# EAGLE design ESP-WROOM-02-Pro-Mini_v1.1 (EAGLE 7.3.0)
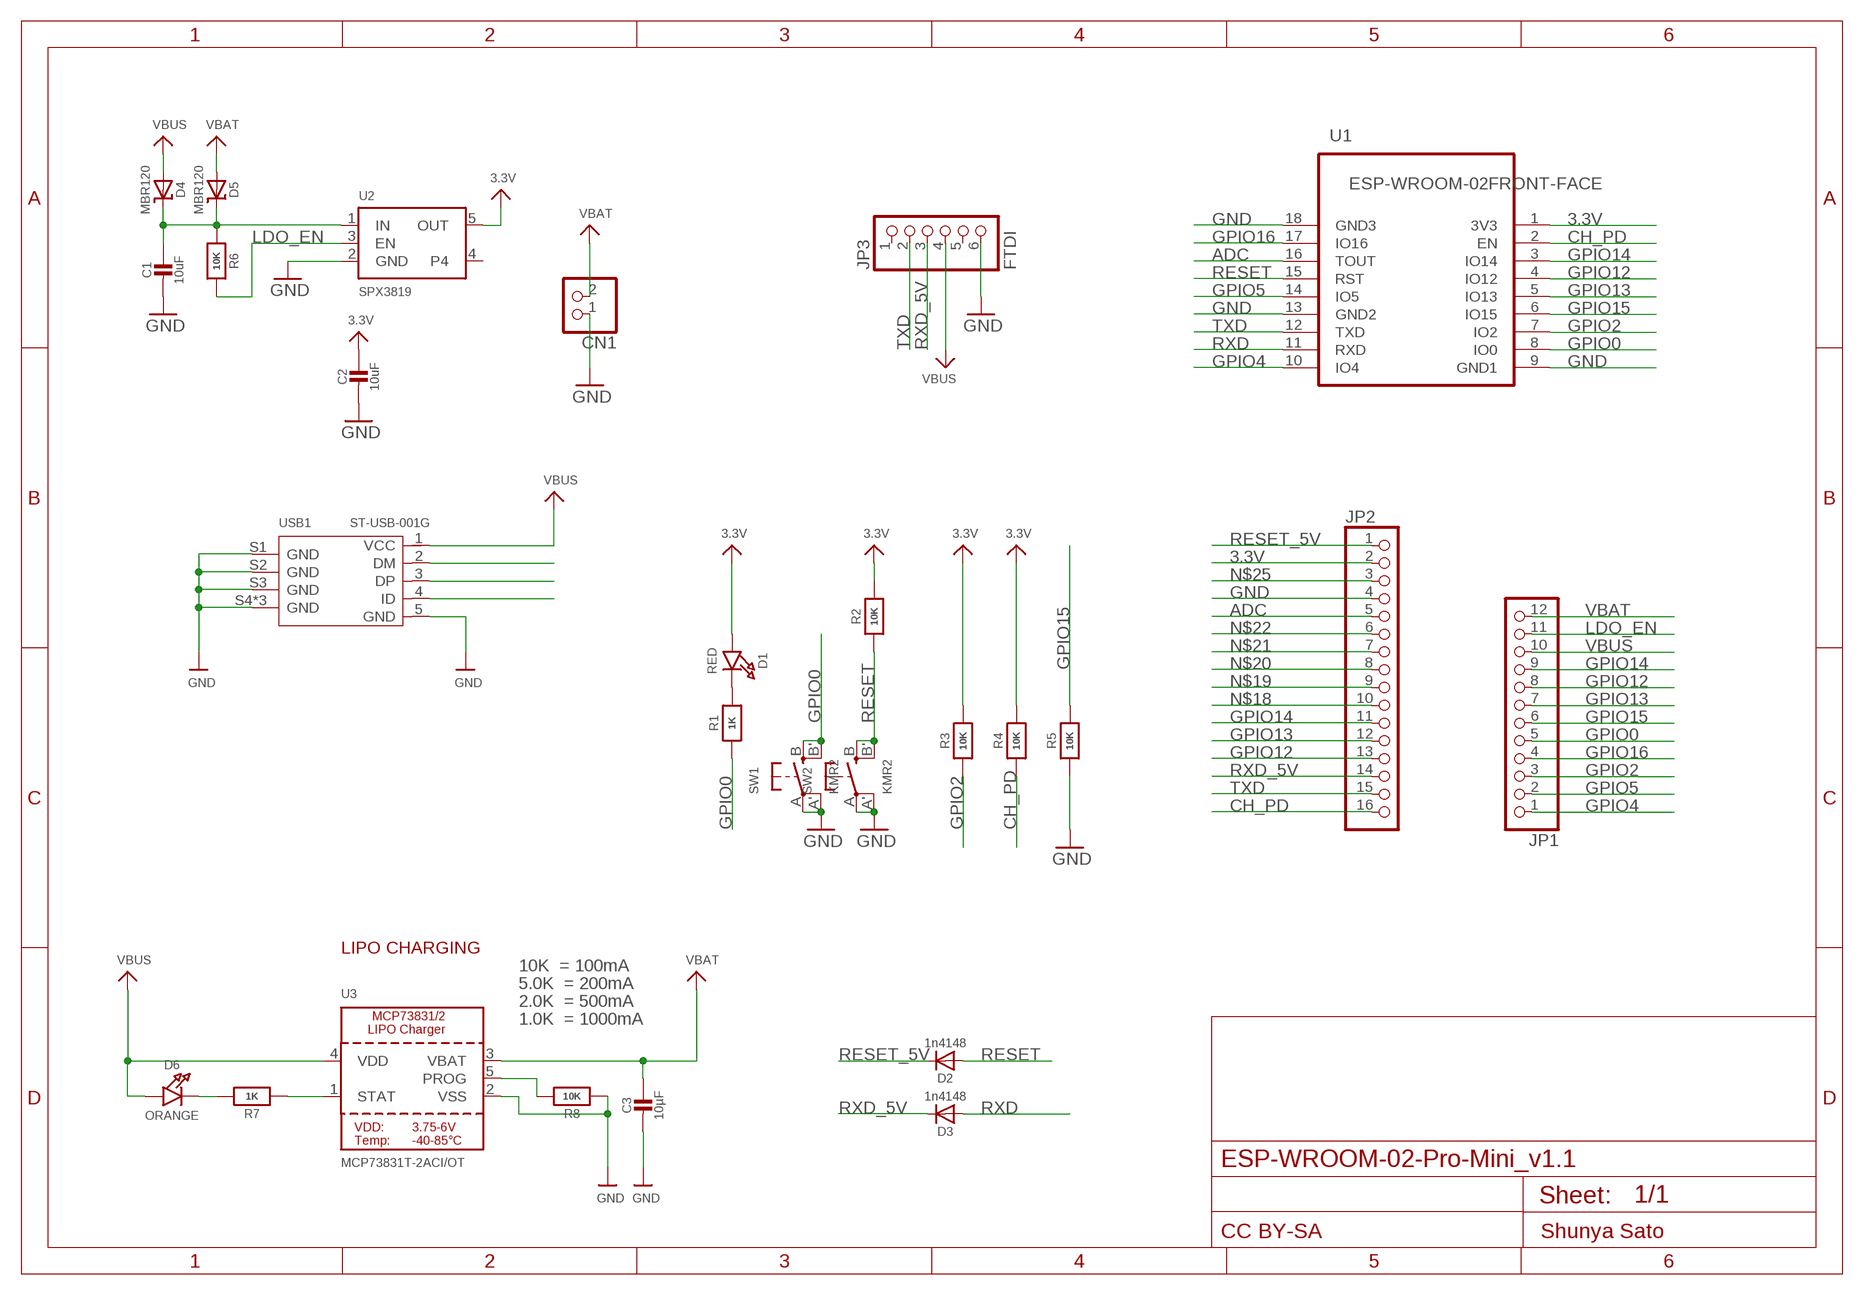
[diagram p0: schematic, sheet 1]

## Parts
C1  10uF  CAP_CERAMIC0805-NOOUTLINE  [0805-NO]
C2  10uF  CAP_CERAMIC0805-NOOUTLINE  [0805-NO]
C3  10µF  CAP_CERAMIC0805-NOOUTLINE  [0805-NO]
CN1  JST_2PIN  [JSTPH2]
D1  RED  LED0805_NOOUTLINE  [CHIPLED_0805_NOOUTLINE]
D2  1n4148  DIODESOD-323  [SOD-323]
D3  1n4148  DIODESOD-323  [SOD-323]
D4  MBR120  DIODE-SCHOTTKYSOD-123  [SOD-123]
D5  MBR120  DIODE-SCHOTTKYSOD-123  [SOD-123]
D6  ORANGE  LED0805_NOOUTLINE  [CHIPLED_0805_NOOUTLINE]
JP1  PINHD-1X12-CB  [1X12-CB]
JP2  HEADER-1X16ROUND  [1X16_ROUND]
JP3  FTDI  HEADER-1X670MIL  [1X06_ROUND_70]
R1  1K  RESISTOR0805_NOOUTLINE  [0805-NO]
R2  10K  RESISTOR0805_NOOUTLINE  [0805-NO]
R3  10K  RESISTOR0805_NOOUTLINE  [0805-NO]
R4  10K  RESISTOR0805_NOOUTLINE  [0805-NO]
R5  10K  RESISTOR0805_NOOUTLINE  [0805-NO]
R6  10K  RESISTOR0805_NOOUTLINE  [0805-NO]
R7  1K  RESISTOR0805_NOOUTLINE  [0805-NO]
R8  10K  RESISTOR0805_NOOUTLINE  [0805-NO]
SW1  KMR2  SWITCH_TACT_SMT4.6X2.8  [BTN_KMR2_4.6X2.8]
SW2  KMR2  SWITCH_TACT_SMT4.6X2.8  [BTN_KMR2_4.6X2.8]
U1  ESP-WROOM-02FRONT-FACE  [FRONT-FACE]
U2  SPX3819  VREG_SOT23-5  [SOT23-5]
U3  MCP73831T-2ACI/OT  MCP73831/2  [SOT23-5]
USB1  ST-USB-001G  MICRO-USB-SMD-B-WITHOUT-POST-W/P(ST-USB-001G)  [MICRO-USB5+4P-SMD-0.65-B]

## Nets
3.3V: C2.1 D1.A JP2.2 R2.2 R3.2 R4.2 U1.1(3V3) U2.5(OUT)
ADC: JP2.5 U1.16(TOUT)
CH_PD: JP2.16 R4.1 U1.2(EN)
GND: C1.2 C2.2 C3.2 CN1.1 JP2.4 JP3.6 R5.1 R8.1 SW1.A'(P1) SW1.A(P) SW2.A'(P1) SW2.A(P) U1.9(GND1) U1.13(GND2) U1.18(GND3) U2.2(GND) U3.2(VSS) USB1.5(GND) USB1.S1(GND) USB1.S2(GND) USB1.S3(GND) USB1.S4(GND) USB1.S5(GND) USB1.S6(GND)
GPIO0: JP1.5 R1.1 SW1.B'(S1) SW1.B(S) U1.8(IO0)
GPIO2: JP1.3 R3.1 U1.7(IO2)
GPIO4: JP1.1 U1.10(IO4)
GPIO5: JP1.2 U1.14(IO5)
GPIO12: JP1.8 JP2.13 U1.4(IO12)
GPIO13: JP1.7 JP2.12 U1.5(IO13)
GPIO14: JP1.9 JP2.11 U1.3(IO14)
GPIO15: JP1.6 R5.2 U1.6(IO15)
GPIO16: JP1.4 U1.17(IO16)
LDO_EN: JP1.11 R6.2 U2.3(EN)
N$1: D6.C R7.2
N$2: R7.1 U3.1(STAT)
N$3: C1.1 D4.C D5.C R6.1 U2.1(IN)
N$6: D1.C R1.2
N$8: USB1.4(ID)
N$14: USB1.3(DP)
N$15: USB1.2(DM)
N$18: JP2.10
N$19: JP2.9
N$20: JP2.8
N$21: JP2.7
N$22: JP2.6
N$25: JP2.3
N$32: R8.2 U3.5(PROG)
RESET: D2.A R2.1 SW2.B'(S1) SW2.B(S) U1.15(RST)
RESET_5V: D2.C JP2.1
RXD: D3.A U1.11(RXD)
RXD_5V: D3.C JP2.14 JP3.3
TXD: JP2.15 JP3.2 U1.12(TXD)
VBAT: C3.1 CN1.2 D5.A JP1.12 U3.3(VBAT)
VBUS: D4.A D6.A JP1.10 JP3.4 U3.4(VDD) USB1.1(VCC)
Unconnected: JP3.1 JP3.5 U2.4

## Notes on the sheet
- LIPO CHARGING
- 10K  = 100mA
- 5.0K  = 200mA
- 2.0K  = 500mA
- 1.0K  = 1000mA
- CC BY-SA | Shunya Sato

## Library data of the parts
C1-C3 = microbuilder:CAP_CERAMIC: Ceramic Capacitors For new designs, use the packages preceded by an '_' character since they are more reliable: The following footprints should be used on most boards: _0402 - Standard footprint for regular board layouts _0603 - Standard footprint for regular board layouts _0805 - Standard footprint for regular board layouts _1206 - Standard footprint for regular board layouts For extremely tight-pitch boards where space is at a premium, the following 'micro-pitch' footprints can be used (smaller pads, no silkscreen outline, etc.): _0402MP - Micro-pitch footprint for very dense/compact boards _0603MP - Micro-pitch footprint for very dense/compact boards _0805MP - Micro-pitch footprint for very dense/compact boards _1206MP - Micro-pitch footprint for very dense/compact boards
CN1 = microbuilder:JST_2PIN: JST 2-Pin Right-Angle Connector PH-Series - 4UConnector: 17311 SH-Series - 4UConnector: 07278
D1 D6 = microbuilder:LED: LED 0603 - 0603 Surface Mount Package 2mA: Green LED - Low Power (3.9mcd, 2ma, 1.7Vf) - Digikey: 475-2709-2-ND Orange LED - Low Power (9.8mcd, 2ma, 1.8Vf) - Digikey: 475-1194-2-ND Red LED - Low Power (5mcd, 2ma, 1.8Vf) - Digikey: 475-1195-2-ND Yellow LED - Low Power (7mcd, 2ma, 1.8Vf) - Digikey: 475-1196-2-ND 5mA: Blue LED - Low Power (17mcd, 5ma, 2.9Vf) - Digikey: LNJ937W8CRACT-ND 0805 - 0805 Surface Mount Package 2mA: Red LED (8.8mcd, 2mA, 1.8Vf, Clear) - Low Power [Digikey: 475-2510-1-ND] Green LED (5mcd, 2mA, 1.8Vf, Clear) - Low Power [Digikey: 475-2730-1-ND] Yellow LED (11.3mcd, 2mA, 1.8Vf, Clear) - Low Power [Digikey: 475-2555-1-ND] 20mA: Red LED (104mcd, 20mA, Diffused) - LS R976 [Digikey: 475-1278-6-ND] Red LED (12mcd, 20mA, 2.0Vf, Clear) - APT2012EC [Digikey: 754-1128-1-ND] Green LED (15mcd, 20mA, 2.2Vf, Clear) - APT2012GC [Digikey: 754-1131-1-ND] Orange LED (160mcd, 20mA, 2.1Vf, Clear) - APT2012SECK [Digikey: 754-1130-1-ND] 1206 - 1206 Surface Mount Package Green LED (26mcd, 20mA, Diffused) - LG N971 [Digikey: 475-1407-6-ND] Red LED (15mcd, 20mA, Diffused) - LH N974 [Digikey: 475-1416-6-ND] Cree - Cree High-Power Surface Mount LEDs XPEBWT-L1-0000-00D50 - White 111lm 350mA 2.9Vf 6200K 110° XTEAWT-00-0000-00000LEE3 - White 114lm 350mA 2.85Vf 5000K 115° Everlight - Everlight 45-21 Series Surface Mount LEDs 45-21/QK2C-B2832AC2CB2/2T - Warm White 2000mcd 20mA 3.25Vf 3050K 120° 45-21/LK2C-B38452C4CB2/2T - Nuetral White 2000mcd 20mA 3.25Vf 4150K 120° 45-21/LK2C-B50634C6CB2/2T - Cold White 2200mcd 20mA 3.25Vf 5650K 120° PLCC2 Reverse Mount LS T77K-J1L2-1-0-2-R18-Z - Red 11.25mcd 2mA 1.8Vf 630nm 120° LO T77K-L1M2-24-Z - Orange 19.6mcd 2mA 1.8Vf 606nm 120° LY T77K-K2M1-26-Z - Yellow 15.7mcd 2mA 1.8Vf 587nm 120°
D2 D3 = microbuilder:DIODE: Diode SMA Model Volts Amps Type Vf Ir Digikey # Notes SSA34-E3 40V 3A Schottky 480mV @ 3A 200uA @ 40V SSA34-E3/61TGITR-ND CDBA120-G 20V 1A Schottky 500mV @ 1A 500uA @ 20V 641-1014-6-ND REEL MBRA210 10V 2A Schottky 350mV @ 2A 700uA @ 10V MBRA210LT3 SOD-123 Model Volts Amps Type Vf Ir Order # Notes BAT54T1G 30V 200mA Schottky 800mV @ 200mA 2uA @ 25V BAT54T1GOSTR-ND B0530W 30V 500mA Schottky 430mV @ 500mA 130uA @ 30V B0530W-FDICT-ND REEL MBR120 20V 1A Schottky 340mV @ 1A MBR120VLSFT1GOSCT-ND SOD-323 Model Volts Amps Type Vf Ir Order # Notes PMEG2005EJ 20V 500mA Schottky 355mV @ 500mA 568-4110-1-ND ZLLS410 10V 570mA Schottky 380mV @ 570mA ZLLS410CT-ND 1N4148WS 75V 150mA Silicon/Simple 1V 1N4148WSFSCT-ND REEL SOD-523 Model Volts Amps Type Vf Ir Order # Notes BAT54XV2 30V 200mA Schottky 0.8V @ 100mA BAT54XV2CT-ND TB751S 30V 30mA Schottky RB751S-40TE61CT-ND SOT23-R/W (R = Solder Paste/Reflow Ovens, W = Hand-Soldering) Model Volts Amps Type Vf Ir Order # Notes BAT54FILM 40V 300mA Schottky 497-7162-1-ND POWERDI-5 Model Volts Amps Type Vf Ir Order # Notes PDS560 60V 5A Schottky 670mV @ 5A 150uA @ 60V PDS560DICT-ND
D4 D5 = microbuilder:DIODE-SCHOTTKY
JP1 = adafruit:PINHD-1X12: PIN HEADER
JP2 = microbuilder:HEADER-1X16: PIN HEADER
JP3 = microbuilder:HEADER-1X6: PIN HEADER
R1-R8 = microbuilder:RESISTOR: Resistors For new designs, use the packages preceded by an '_' character since they are more reliable: The following footprints should be used on most boards: _0402 - Standard footprint for regular board layouts _0603 - Standard footprint for regular board layouts _0805 - Standard footprint for regular board layouts _1206 - Standard footprint for regular board layouts For extremely tight-pitch boards where space is at a premium, the following 'micro-pitch' footprints can be used (smaller pads, no silkscreen outline, etc.): _0402MP - Micro-pitch footprint for very dense/compact boards _0603MP - Micro-pitch footprint for very dense/compact boards _0805MP - Micro-pitch footprint for very dense/compact boards _1206MP - Micro-pitch footprint for very dense/compact boards
SW1 SW2 = microbuilder:SWITCH_TACT_SMT: SMT Tact Switches 6x6mm - Digikey: P12940SCT-ND KMR2 (4.6x2.8mm) - Digikey: 401-1426-1-ND EVQ-PQHB55 - Light Touch, 160GF (4.5x4.5mm) - Digikey: P8090SCT-ND KMT0 - KMT021 NGJ LHS (etc.) IP68/Waterproof - Digikey: CKN10289CT-ND
U1 = esp-wroom-02:ESP-WROOM-02: WiFi module - ESP-WROOM-02
U2 = microbuilder:VREG_SOT23-5: SOT23-5 Fixed Voltage Regulators Part Current Out V Out V In V Dropout θJA (°C/W) TJ (°C) Digikey Part No. ADP121 150mA 3.3V 3.4-5.5V 0.09V @ 150mA -- -- ADP121-AUJZ33R7CT-ND ADP121 150mA 3.0V 3.1-5.5V 0.09V @ 150mA -- -- ADP121-AUJZ30R7CT-ND ADP122 300mA 3.3V 3.4-5.5V 0.085V @ 300mA -- -- ADP122AUJZ-3.3-R7CT-ND ADP1712 300mA 3.3V 3.5-5.5V 0.17V @ 300mA -- -- ADP1712AUJZ-3.3-R7TR-ND AP7311 (Low Cost) 150mA 3.3V 3.5-6V 0.15V @ 150mA -- -- AP7311-33WG-7DICT-ND LD39015M18R 150mA 1.8V 1.9V-5.5V 0.08V @ 100mA -- -- 497-6977-1-ND LP2985A-33DBVR 150mA 3.3V 3.3-16V 0.28V @ 150mA 206 150 296-18479-1-ND MCP1824T-3302E/OT 300mA 3.3V 3.5V-6V 0.2V @ 300mA -- -- MCP1824T-3302E/OTCT-ND MIC5205-2.5YM5 TR 150mA 2.5V 2.7-16V 0.165V @ 150mA -- -- 576-1257-2-ND MIC5205-3.0YM5 TR 150mA 3.0V 3.2V-16V 0.165V @ 150mA -- -- 576-1258-2-ND MIC5205-3.3YM5 TR 150mA 3.3V 3.5V-16V 0.165V @ 150mA -- -- 576-1259-2-ND TPS780330220 150mA 3.3V+2.2V 3.6-5.5V 250mV Max -- -- 296-23332-1-ND TDA3663/N1,135 100mA 3.3V 3.5-45V 0.18V @ 50mA -- -- 568-5343-1-ND Max operating temp can be calculated using θJA, TJ (max junction temperature), and power in watts. Set the "Maximum Ambient Temperature" until it reaches TJ ("Max Junction Temperature"), which is the absolute limit for safe use of the regulator: Heat Sink Temperature Calculator <http://www.daycounter.com/Calculators/Heat-Sink-Temperature-Calculator.phtml> For example, With 12V source into a 3.3V LP2985 and a 30mA load, we are dissipating (12V-3.3V) * 0.03A = 0.261W. With a θJA of 206 °C/W, a TJ of 150°C, and 261mW we can safely use the chip without a heat sink up to 75°C (=147.1°C Junction Temperature).
U3 = microbuilder:MCP73831/2: MCP73831/2 LIPO Charger VDD: 3.75 - 6V Temp -40 - 85°C Programmable Charge Rate: 15-500mA NOTE: STAT is a tri-state logic output on the MCP73831 and an open-drain output on the MCP73832. SOT23-5 with 4.2V output and tri-state logic on STAT = MCP73831T-2ACI/OT
USB1 = Seeed-OPL-Connector:MICRO-USB-SMD-B-WITHOUT-POST-W/P(ST-USB-001G): 320010000; MPN: ST-USB-001G

## Board
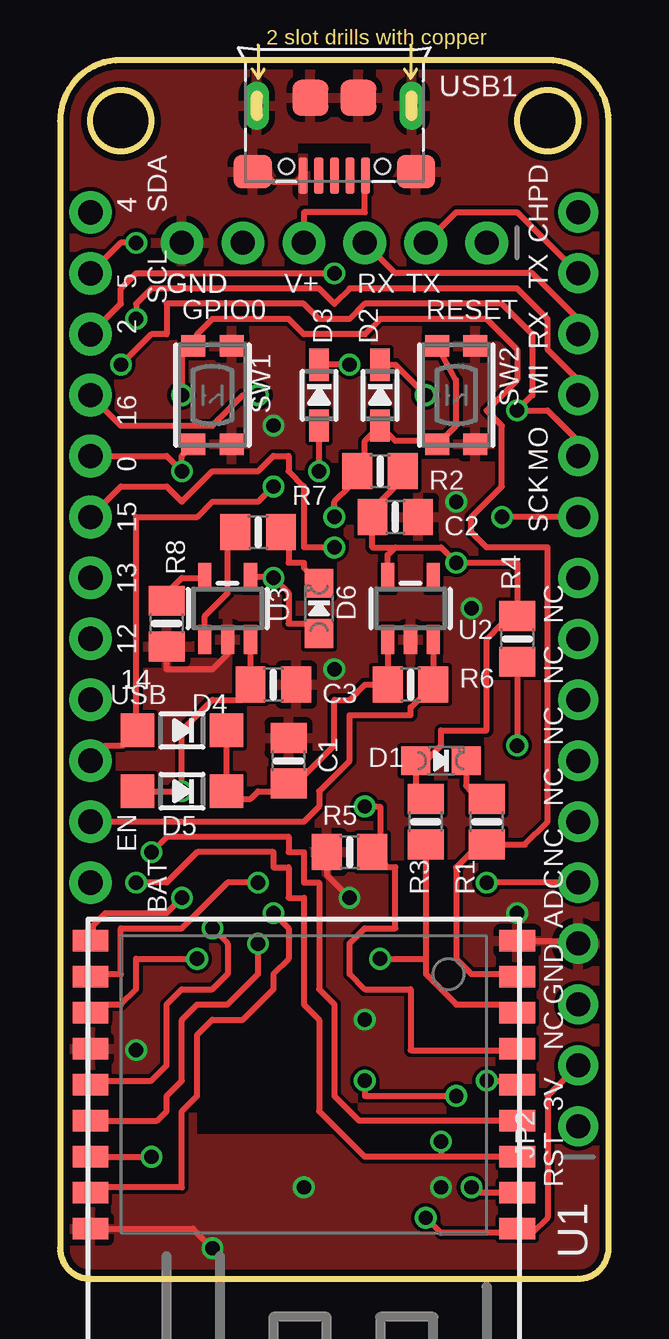
[diagram p1: board, top side]
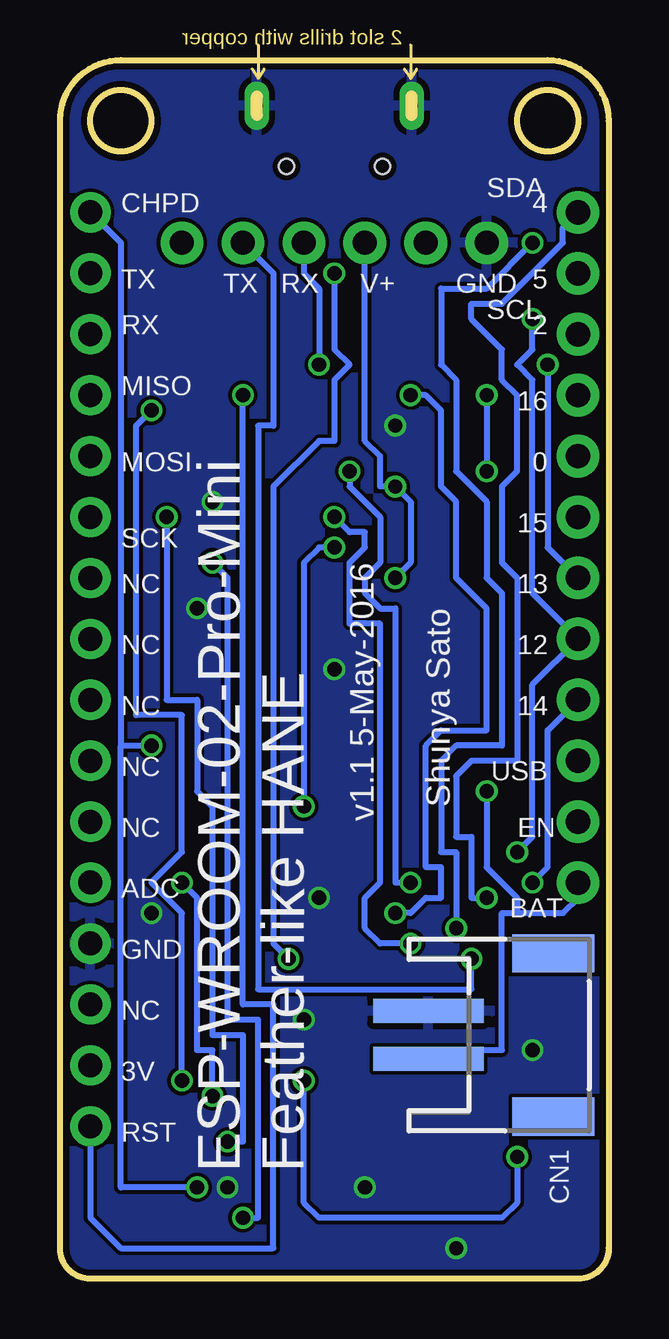
[diagram p2: board, bottom side, seen from below]

Size 22.86 x 50.8 mm. Coordinates in mm from the lower left corner, seen from the top.
Outline: 22.86,1.27 22.86,48.26 arc90 20.32,50.8 2.54,50.8 arc90 0,48.26 0,1.27 arc90 1.27,0 21.59,0 arc90 22.86,1.27
Outline: circle at 2.54,48.26 radius 1.27
Outline: circle at 20.32,48.26 radius 1.27
Copper layers (1*16): Top 0.035mm / dielectric 1.5mm / Bottom 0.035mm
Design rules "SeeedStudio_2layer_DRU_no_angle_20140221": minimum track width 6mil, minimum drill 12mil, track to track 6mil, track to pad 6mil, pad to pad 6mil, via to via 6mil, smd to smd 0mil, copper to edge 10mil, drill to drill 10mil, minimum pad ring 10mil, minimum via ring 6mil, stop-mask expansion 2mil, vias tented up to drill 100mil, thermal gap 10mil

### Footprints (pad centres in the part's own frame; a part is rotated, then mirrored left to right if it is on the bottom)
0805-NO = smd 1.24 x 1.5: 1 -0.95,0; 2 0.95,0
JSTPH2 = smd 1 x 4.6: 1 -1,-3.7; 2 1,-3.7 | smd 1.6 x 3.4: NC1 -3.4,1.5; NC2 3.4,1.5
CHIPLED_0805_NOOUTLINE = smd 1.2 x 1.2: A 0,-1.05; C 0,1.05
SOD-323 = smd 1.35 x 0.8: A 1.27,0; C -1.27,0
SOD-123 = smd 1.4 x 1.4: A 1.85,0; C -1.85,0
1X12-CB = drill 1.016 pad 1.778: 1 -13.97,0; 2 -11.43,0; 3 -8.89,0; 4 -6.35,0; 5 -3.81,0; 6 -1.27,0; 7 1.27,0; 8 3.81,0; 9 6.35,0; 10 8.89,0; 11 11.43,0; 12 13.97,0
1X16_ROUND = drill 1 pad 1.676: 1 -19.05,0; 2 -16.51,0; 3 -13.97,0; 4 -11.43,0; 5 -8.89,0; 6 -6.35,0; 7 -3.81,0; 8 -1.27,0; 9 1.27,0; 10 3.81,0; 11 6.35,0; 12 8.89,0; 13 11.43,0; 14 13.97,0; 15 16.51,0; 16 19.05,0
1X06_ROUND_70 = drill 1 pad 1.778: 1 -6.35,0; 2 -3.81,0; 3 -1.27,0; 4 1.27,0; 5 3.81,0; 6 6.35,0
BTN_KMR2_4.6X2.8 = smd 0.9 x 1: A 2.05,0.8; A' -2.05,0.8; B 2.05,-0.8; B' -2.05,-0.8
FRONT-FACE = smd 1.485 x 0.9: 1 -8.893,4.9; 2 -8.893,3.4; 3 -8.893,1.9; 4 -8.893,0.4; 5 -8.893,-1.1; 6 -8.893,-2.6; 7 -8.893,-4.1; 8 -8.893,-5.6; 9 -8.893,-7.1; 10 8.893,-7.1; 11 8.893,-5.6; 12 8.893,-4.1; 13 8.893,-2.6; 14 8.893,-1.1; 15 8.893,0.4; 16 8.893,1.9; 17 8.893,3.4; 18 8.893,4.9
SOT23-5 = smd 0.55 x 1.2: 1 -0.95,-1.3; 2 0,-1.3; 3 0.95,-1.3; 4 0.95,1.3; 5 -0.95,1.3
MICRO-USB5+4P-SMD-0.65-B = smd 0.381 x 1.524: 1 -1.3,-0.25; 2 -0.65,-0.25; 3 0,-0.25; 4 0.65,-0.25; 5 1.3,-0.25 | smd 1.6 x 1.397: S1 -3.4,-0.427; S6 3.4,-0.427 | drill 0.508 pad 1.016 long: S2 -3.226,-3.175; S5 3.226,-3.175 | smd 1.5 x 1.5: S3 -1,-3.5; S4 1,-3.5 | hole 0.635: -2,-0.65; 2,-0.65

### Placement (x,y rotation side)
C1  9.52,21.59 90 top
C2  13.97,31.75 0 top
C3  8.89,24.77 0 top
CN1  3.81,10.16 270 bottom
D1  15.88,21.59 270 top
D2  13.33,36.83 270 top
D3  10.79,36.83 270 top
D4  5.08,22.86 180 top
D5  5.08,20.32 180 top
D6  10.79,27.94 0 top
JP1  1.27,30.48 270 top
JP2  21.59,25.4 90 top
JP3  11.43,43.18 180 top
R1  17.78,19.05 90 top
R2  13.33,33.66 0 top
R3  15.24,19.05 90 top
R4  19.05,26.67 90 top
R5  12.06,17.78 0 top
R6  14.6,24.77 0 top
R7  8.25,31.11 0 top
R8  4.45,27.3 90 top
SW1  6.35,36.83 270 top
SW2  16.51,36.83 270 top
U1  10.16,6.99 180 top
U2  14.6,27.94 0 top
U3  6.98,27.94 0 top
USB1  11.43,45.72 180 top

### Tracks (layer width: path | path; a pad name or v marks a point on that pad's centre or on a via)
3.3V  (via drill 0.6)
  Top 0.254: 19.23,1.91 15.88,1.91 v15.24,2.54 | 19.23,1.91 19.68,1.91 20.32,2.54 20.32,7.62 JP2.2 | 19.23,1.91 U1.1 | C2.1 13.33,31.75 | 13.97,30.48 13.02,30.48 C2.1 | 13.97,30.48 15.88,30.48 v16.51,29.84 19.05,29.84 R4.2 18.73,27.3 18.41,27.3 17.78,26.67 17.78,22.86 15.88,22.86 15.88,22.23 15.24,21.59 D1.A 14.82,20.41 R3.2 | C2.1 12.7,31.75 13.02,31.43 13.33,31.43 | R2.2 14.28,33.34 13.33,32.38 13.33,32.06 C2.1 | U2.5 13.65,30.16 13.97,30.48
  Bottom 0.254: v15.24,2.54 14.6,2.54 14.6,10.79 15.88,10.79 15.88,29.21 v16.51,29.84
ADC  (via drill 0.6)
  Top 0.254: v12.7,8.26 12.7,7.62 v16.51,7.62 | JP2.5 v17.78,16.51 | U1.16 v3.8,5.08 v3.81,5.08
  Bottom 0.254: v12.7,8.26 12.7,3.17 12.06,2.54 4.45,2.54 3.81,3.17 v3.81,5.08 | v16.51,7.62 16.51,9.53 17.14,9.53 17.14,15.88 v17.78,16.51
CH_PD  (via drill 0.6)
  Top 0.254: U1.2 17.37,3.58 v17.14,3.81 | R4.1 v19.05,22.23
  Bottom 0.254: v17.14,3.81 20.32,3.81 20.32,22.23 | 20.32,22.23 20.32,43.18 JP2.16 | 20.32,22.23 v19.05,22.23
GND  (via drill 0.6)
  Top 0.254: U1.9 21.47,14.09 JP2.4 | USB1.S6 8.46,46.15 8.89,45.72 9.88,45.72 USB1.5 | U1.18 5.53,2.08 v6.35,1.27 | U3.2 6.98,26.04 6.35,25.4 4.45,25.4 R8.1 | R5.1 11.11,16.82 v12.06,15.88
  other vias: 10.16,3.81 3.17,9.53 8.89,35.56 16.51,32.38 11.43,25.4 12.7,10.79 15.88,3.81 19.05,15.24 17.14,27.94
  pour Bottom: 22.86,0 22.86,50.8 0,50.8 0,0
  pour Top: 22.86,0 22.86,50.8 0,50.8 0,0
GPIO0  (via drill 0.6)
  Top 0.254: U1.8 18.94,12.7 17.14,12.7 16.51,13.34 16.51,17.14 17.46,18.1 R1.1 | 17.78,18.41 17.46,18.41 R1.1 | SW1.B' 5.86,38.88 | v5.08,36.83 5.08,38.41 SW1.B' | JP1.5 4.45,34.29 v5.08,33.66 5.08,34.31 SW1.B | R1.1 19.37,18.1 20.32,19.05 20.32,30.48 17.78,30.48 17.14,31.11 17.14,31.75 18.41,33.02 18.41,35.56 17.78,36.2 19.05,37.47 19.05,38.73 17.78,40.01 13.33,40.01 12.7,39.37 10.16,39.37 9.52,40.01 6.35,40.01 5.71,39.37 5.71,39.05 SW1.B'
  Bottom 0.254: v5.08,36.83 v5.08,33.66
GPIO2  (via drill 0.6)
  Top 0.254: R3.1 15.24,13.34 | 15.24,13.34 15.24,12.7 16.51,11.43 18.71,11.43 U1.7 | v11.43,41.91 3.17,41.91 2.54,41.27 2.54,40.64 JP1.3 | v13.33,13.34 15.24,13.34
  Bottom 0.254: v11.43,41.91 11.43,38.73 10.79,38.1 11.43,37.47 11.43,34.92 12.06,34.92 13.97,33.02 13.97,13.97 v13.33,13.34
GPIO4  (via drill 0.6)
  Top 0.254: U1.10 1.38,13.97 1.38,14.72 1.9,15.24 4.45,15.24 v5.08,15.88
  Bottom 0.254: v5.08,15.88 5.71,15.88 5.71,18.41 6.35,18.41 6.35,20.95 5.71,21.59 3.81,21.59 3.81,29.21 4.45,29.84 4.45,33.02 3.81,33.66 3.81,36.83 4.45,37.47 4.45,38.73 5.71,40.01 5.71,40.64 4.45,40.64 1.9,43.18 1.9,43.81 JP1.1
GPIO5  (via drill 0.6)
  Top 0.254: U1.14 1.44,8.26 3.81,8.26 4.45,8.89 4.45,11.43 5.08,12.06 6.35,12.06 6.98,12.7 6.98,13.97 v6.35,14.61 | v3.17,43.18 2.54,43.18 JP1.2
  Bottom 0.254: v6.35,14.61 6.35,17.78 6.98,17.78 6.98,21.59 6.35,22.23 4.45,22.23 4.45,28.57 5.08,29.21 5.08,32.38 6.35,33.66 6.35,37.47 6.98,38.1 6.98,41.27 5.08,41.27 v3.17,43.18
GPIO12  (via drill 0.6)
  Top 0.254: U1.4 12.46,6.58 11.43,7.62 11.43,11.43 10.79,12.06 10.79,16.51 10.16,16.51 10.16,17.78 9.52,17.78 9.52,18.41 4.45,18.41 v3.81,17.78 | JP2.13 21.59,37.47 20.32,38.73 20.32,40.01 19.05,41.27 12.06,41.27 11.43,40.64 10.79,41.27 3.81,41.27 3.17,40.64 v3.17,40.01
  Bottom 0.254: v3.81,17.78 3.17,18.41 3.17,24.77 JP1.8 3.17,28.57 3.17,37.47 3.81,38.1 3.17,38.73 v3.17,40.01
GPIO13  (via drill 0.6)
  Top 0.254: v17.78,8.26 18.88,8.26 U1.5 | JP2.12 21.59,34.92 20.32,36.2 v19.05,36.2 19.68,36.83 19.68,39.37 18.41,40.64 12.7,40.64 12.06,40.01 10.79,40.01 10.16,40.64 4.45,40.64 4.45,39.37 3.81,39.37 v2.54,38.1
  Bottom 0.254: v17.78,8.26 17.78,15.24 19.05,16.51 17.78,17.78 17.78,23.5 19.68,23.5 19.68,35.56 v19.05,36.2 | JP1.7 2.54,30.48 v2.54,38.1
GPIO14  (via drill 0.6)
  Top 0.254: U1.3 15.88,5.08 | 15.88,5.08 12.7,5.08 10.79,6.99 10.79,10.79 10.16,11.43 10.16,15.88 9.52,15.88 9.52,17.14 8.89,17.14 8.89,17.78 5.71,17.78 4.45,16.51 v3.17,16.51 | v15.88,5.71 15.88,5.08 | JP2.11 v18.41,31.75
  Bottom 0.254: v3.17,16.51 2.54,17.14 2.54,22.86 JP1.9 | v18.41,31.75 18.41,24.13 17.14,24.13 17.14,20.32 16.51,19.68 16.51,10.16 15.24,10.16 15.24,5.71 v15.88,5.71
GPIO15  (via drill 0.6)
  Top 0.254: U1.6 18.99,9.53 14.6,9.53 14.6,12.06 12.7,12.06 12.06,12.7 12.06,13.97 12.7,14.61 13.97,14.61 13.97,17.14 13.65,17.14 R5.2 | v12.7,19.68 13.33,19.68 13.33,18.1 R5.2 | 13.33,18.09 R5.2 | v11.43,30.48 10.16,30.48 10.16,33.02 9.52,33.66 9.52,34.29 8.89,34.29 8.25,33.66 6.35,33.66 5.08,32.38 4.45,33.02 2.54,33.02 JP1.6
  Bottom 0.254: v12.7,19.68 12.7,29.84 12.06,30.48 v11.43,30.48
GPIO16  (via drill 0.6)
  Top 0.254: JP1.4 2.54,35.56 6.35,35.56 7.62,36.83 v8.25,36.83 | v8.89,15.24 9.52,14.61 9.52,13.34 8.89,12.7 8.89,12.06 7.62,10.79 6.35,10.79 5.71,10.16 5.71,7.62 5.08,6.99 5.08,3.81 1.49,3.81 U1.17
  Bottom 0.254: v8.25,36.83 7.62,36.83 6.98,36.2 6.98,33.02 6.35,32.38 6.35,29.21 5.08,27.94 5.08,22.86 6.98,22.86 7.62,22.23 7.62,17.14 6.98,17.14 6.98,15.88 7.62,15.88 8.25,15.24 v8.89,15.24
LDO_EN
  Top 0.254: U2.3 R6.2 14.6,23.82 14.6,23.5 12.06,23.5 12.06,21.59 10.79,20.32 10.79,19.68 10.16,19.05 JP1.11
N$1
  Top 0.254: R7.2 9.52,30.8 9.52,29.84 10.16,29.84 10.16,29.62 D6.C
N$2
  Top 0.254: U3.1 6.03,27.62 6.98,28.57 6.98,30.8 R7.1
N$3
  Top 0.254: D4.C D5.C 7.24,20 7.94,20 8.25,20.32 9.2,20.32 | 9.2,20.32 C1.1 9.84,20.64 11.43,22.23 11.43,24.13 12.06,24.13 12.7,24.77 R6.1 U2.1 | 9.2,20.32 9.52,20.32
N$6
  Top 0.254: D1.C 16.92,20.54 17.14,20.32 17.46,20.32 R1.2
N$32
  Top 0.254: R8.2 4.45,28.57 5.08,29.21 6,29.21 U3.5
RESET  (via drill 0.6)
  Top 0.254: R2.1 12.06,33.66 | SW2.B' 16.49,37.47 16.51,37.47 16.51,35.56 15.71,34.76 SW2.B 15.38,34.78 15.24,34.92 13.97,34.92 D2.A 12.7,34.92 12.7,33.97 R2.1 | v11.43,31.75 11.43,32.38 12.06,33.02 12.06,33.34 R2.1 | U1.15 4.04,6.58 4.45,6.99 4.45,7.62 5.08,8.26 5.08,10.79 5.71,11.43 6.98,11.43 8.25,12.7 v8.25,13.97
  Bottom 0.254: v8.25,13.97 9.52,13.97 10.16,14.61 10.16,15.88 9.52,16.51 9.52,27.3 10.79,27.3 10.79,29.84 10.16,30.48 10.16,31.11 10.79,31.11 v11.43,31.75
RESET_5V  (via drill 0.6)
  Top 0.254: D2.C 13.97,38.1 v15.24,36.83
  Bottom 0.254: v15.24,36.83 15.24,11.43 13.97,11.43 13.97,1.27 20.32,1.27 21.59,2.54 JP2.1
RXD  (via drill 0.6)
  Top 0.254: v8.25,16.51 6.98,16.51 5.08,14.61 2.54,14.61 2.54,12.7 1.38,12.7 U1.11 | v10.79,33.66 D3.A
  Bottom 0.254: v10.79,33.66 10.79,33.02 9.52,31.75 9.52,29.84 10.16,29.21 10.16,28.57 9.52,27.94 8.89,27.94 8.89,16.51 v8.25,16.51
RXD_5V  (via drill 0.6)
  Top 0.254: JP3.3 13.97,41.91 19.68,41.91 21.59,40.01 JP2.14 | v12.06,38.1 D3.C
  Bottom 0.254: JP3.3 12.7,41.91 12.06,41.27 v12.06,38.1
TXD  (via drill 0.6)
  Top 0.254: 1.9,10.79 1.9,11.43 | U1.12 1.56,11.09 1.9,11.43 | JP3.2 16.51,44.45 19.05,44.45 JP2.15 | 1.9,11.43 2.54,11.43 3.17,12.06 3.17,13.34 v5.71,13.34
  Bottom 0.254: JP3.2 13.97,41.91 13.97,35.56 14.6,35.56 14.6,12.06 5.71,12.06 v5.71,13.34
VBAT  (via drill 0.6)
  Top 0.254: D5.A v5.08,20.32 5.08,22.86 6.35,24.13 7.62,24.13 7.62,24.45 C3.1 U3.3
  Bottom 0.254: 3.81,15.24 4.45,15.24 4.45,9.53 7.14,9.53 CN1.2 | 3.81,15.24 1.9,15.24 1.27,15.88 JP1.12 | v5.08,20.32 5.08,17.14 3.81,15.88 3.81,15.24
VBUS  (via drill 0.6)
  Top 0.254: JP3.4 10.16,44.45 12.7,44.45 12.7,45.94 USB1.1 | U3.4 8.86,29.24 v8.89,29.21 9.52,28.57 9.52,27.3 10.38,27.3 D6.A | v8.89,33.02 8.25,32.38 6.35,32.38 5.71,31.75 3.17,31.75 3.17,22.86 3.23,22.8 D4.A 2.59,22.23 1.9,22.23 JP1.10
  Bottom 0.254: JP3.4 10.16,34.92 9.52,34.29 9.52,33.02 v8.89,33.02 8.25,32.38 8.25,29.84 v8.89,29.21

### Text on the board
tNames: 4 | SDA | CHPD | GND | GND | V+ | RX | TX | 5 | SCL | TX | GPIO0 | RESET | 2 | RX | MI | 16 | 0 | MO | 15 | SCK | 13 | NC | 12 | 14 | USB | NC | NC | NC | EN | NC | BAT | ADC | GND | NC | 3V | RST
bNames: SDA | 4 | CHPD | GND | V+ | RX | TX | 5 | TX | SCL | 2 | RX | MISO | 16 | 0 | MOSI | 15 | v1.1 5-May-2016 | SCK | 13 | NC | Shunya Sato | 12 | NC | 14 | NC | USB | NC | EN | NC | BAT | ADC | GND | NC | 3V | RST | ESP-WROOM-02-Pro-Mini / Feather-like HANE